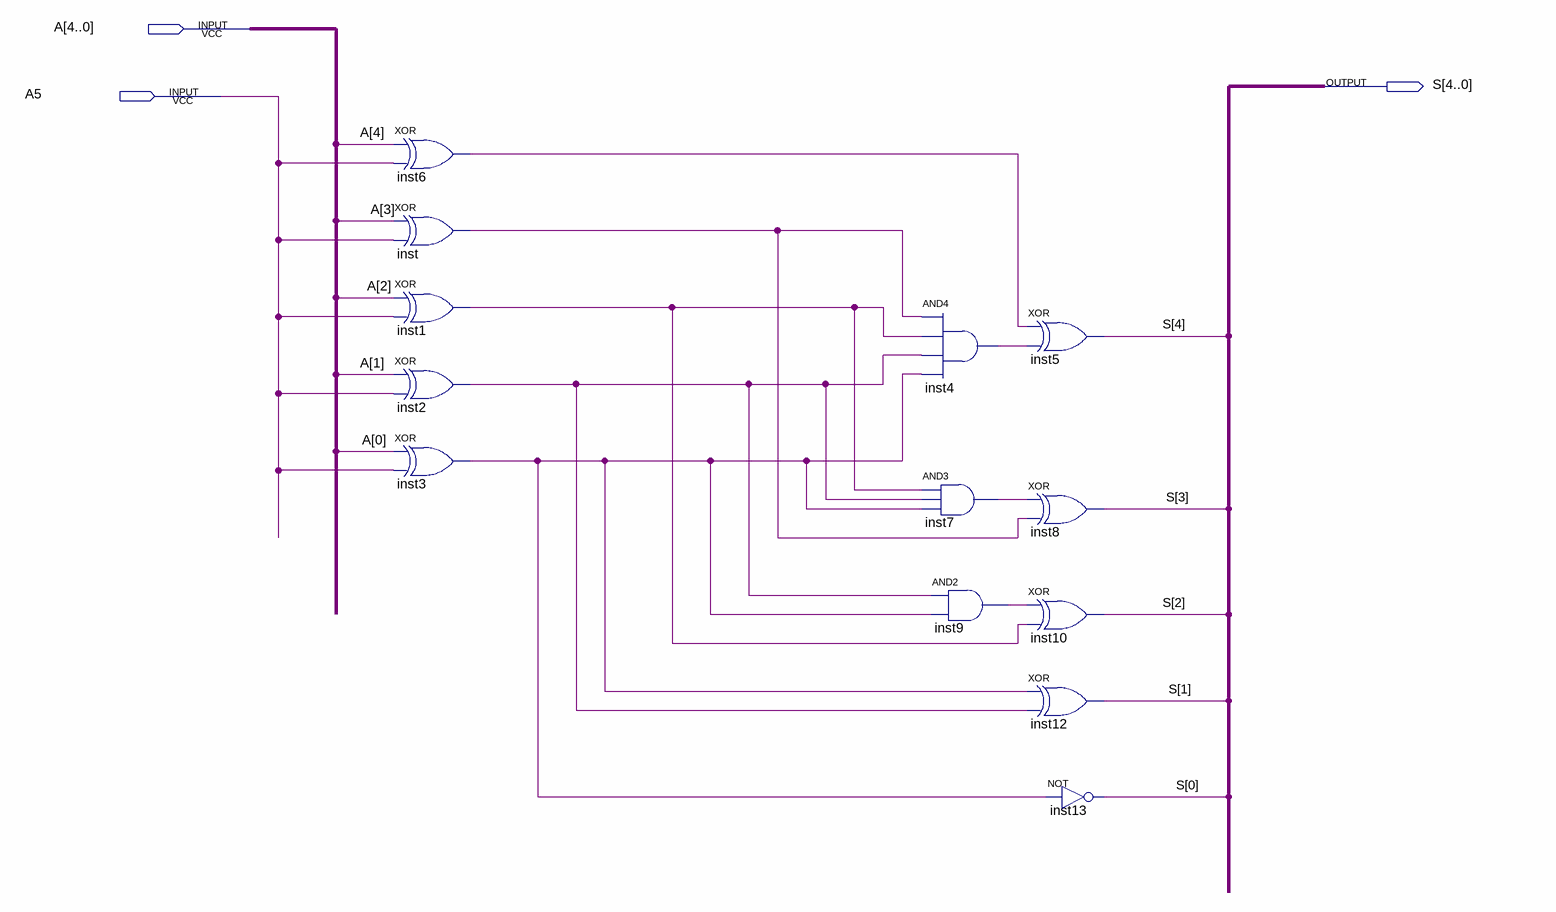
[diagram p0: schematic sheet]
// Quartus schematic complemento2_saida.bdf as structural Verilog: 13 symbols, 3 pins
module complemento2_saida (
  input  [4:0] A,
  input  A5,
  output [4:0] S
);

  wire inst1_out, inst2_out, inst3_out, inst4_out, inst6_out, inst7_out, inst9_out, inst_out;

  xor inst6 (inst6_out, A[4], A5);
  xor inst (inst_out, A[3], A5);
  xor inst1 (inst1_out, A[2], A5);
  xor inst2 (inst2_out, A[1], A5);
  xor inst3 (inst3_out, A[0], A5);
  and inst4 (inst4_out, inst_out, inst1_out, inst2_out, inst3_out);
  and inst7 (inst7_out, inst1_out, inst2_out, inst3_out);
  and inst9 (inst9_out, inst2_out, inst3_out);
  xor inst5 (S[4], inst6_out, inst4_out);
  xor inst8 (S[3], inst7_out, inst_out);
  xor inst10 (S[2], inst9_out, inst1_out);
  xor inst12 (S[1], inst3_out, inst2_out);
  not inst13 (S[0], inst3_out);
endmodule
